# Altium schematic sheet ANTENA.SchDoc
size A4; SheetNumber: 6; SheetTotal: 5
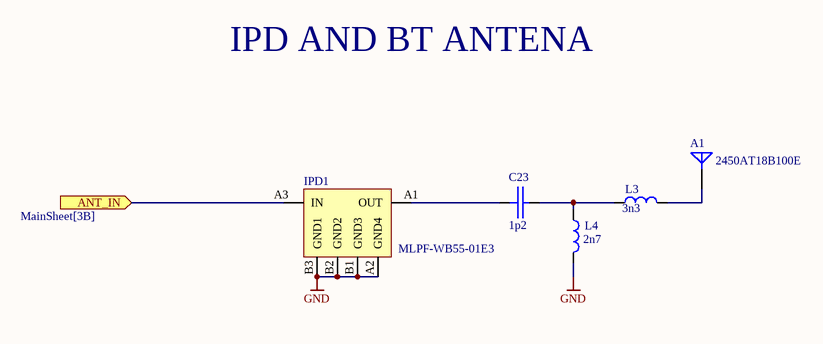
[diagram p0: ANTENA.SchDoc]

## Parts
A1  2450AT18B100E  [ANT_2450AT18B100E]
C23  1p2  [0402]
IPD1  MLPF-WB55-01E3  [IPD]
L3  3n3  [0402]
L4  2n7  [0402]

## Ports
ANT_IN (in, see MainSheet[3B])

## Nets
GND: IPD1.A2(GND4) IPD1.B1(GND3) IPD1.B2(GND2) IPD1.B3(GND1) L4.2
ANT_IN: IPD1.A3(IN) ; port ANT_IN
NetA1_1: A1.1 L3.2
NetC23_1: C23.1 IPD1.A1(OUT)
NetC23_2: C23.2 L3.1 L4.1

## Notes on the sheet
- IPD AND BT ANTENA

## Library data of the parts
A1 = 2450AT18B100E: Antena, 2.45GHz; Manufacturer: Johanson; Supplier 1: Mouser; Manufacturer Part Number: 2450AT18B100E; Category: RF Antennas; Case/Package: SMD-2, 3,8x1,8mm; ComponentLink1Description: https://datasheet.ciiva.com/24025/antenna-2450at18b100-242422-24025839.pdf?src-supplier=Mouser; Supplier Part Number 1: 609-2450AT18B100E
C23 = 609-QSCF500Q1R2B1GV0: Kondenzator, C0G, 10%, 50VDC; Manufacturer: Johanson; Manufacturer Part Number: 500R07S1R2BV4T; Capacitance: 1.2pF; Value: 1.2pF; Supplier 1: Mouser; Category: Ceramic Capacitors; Case/Package: 0402; ComponentLink1Description: https://datasheet.ciiva.com/1461/1731432-1461669.pdf?src-supplier=Element14; Supplier Part Number 1: 609-500R07S1R2BV4T; Supplier 2: Arrow Electronics; Supplier Part Number 2: 500R07S1R2BV4T; Case: 0402
IPD1 = MLPF-WB55-01E3: RF Filtar, 2.4-2.5GHz; Manufacturer: STMicroelectronics; Supplier 1: Mouser; Manufacturer Part Number: MLPF-WB55-01E3; ComponentLink1Description: http://www.farnell.com/datasheets/2802556.pdf?src-supplier=Farnell; Supplier Part Number 1: 511-MLPF-WB55-01E3; Category: Integrated Passive Device; Case/Package: SMD-6, 1,6x1 mm
L3 = BSCH1005053N3SCS: Zavojnica, neoklopljena, 400mADC; Manufacturer: Johanson; Manufacturer Part Number: L-07C3N3SV6T; Value: 3.3nH; Supplier 1: Mouser; Supplier Part Number 1: 609-L-07C3N3SV6T; Category: Fixed Inductors; Case/Package: 0402; Supplier 2: Farnell; Supplier Part Number 2: 3773633; Kučište: 0402
L4 = LRC0402CS2N7GV001T: RF zavojnica, neoklopljena, 300mADC; Manufacturer: Johanson; Manufacturer Part Number: L-07C2N7SV6T; Value: 2.7nH; Supplier 1: Mouser; Category: Fixed Inductors; Case/Package: 0402; ComponentLink1Description: https://datasheet.ciiva.com/1473/1168792-1473898.pdf?src-supplier=Element14; Supplier Part Number 1: 609-L-07C2N7SV6T; Supplier 2: DigiKey; Supplier Part Number 2: 712-LRC0402CS2N7GV001TCT-ND; Kučište: 0402